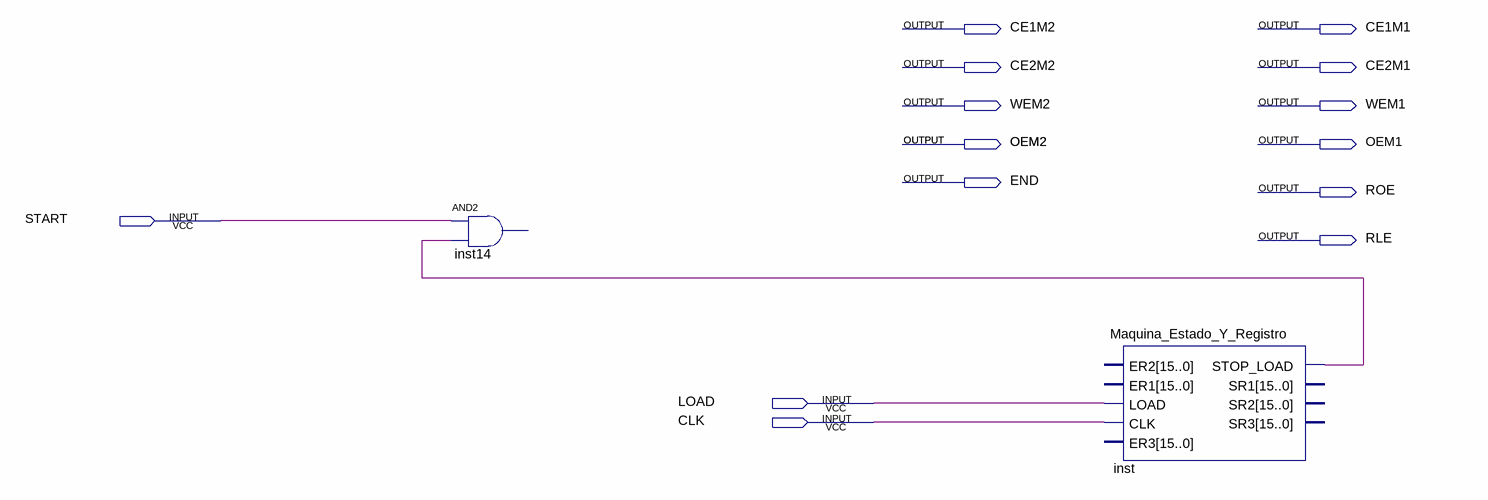
[diagram p0: schematic sheet]
// Quartus schematic Modulo_de_control_general.bdf as structural Verilog: 2 symbols, 15 pins
module Modulo_de_control_general (
  input  START,
  input  LOAD,
  input  CLK,
  output CE1M2,
  output CE1M1,
  output CE2M2,
  output CE2M1,
  output WEM2,
  output WEM1,
  output OEM2,
  output OEM1,
  output END,
  output ROE,
  output RLE
);

  wire inst_stop_load;

  // AND2 inst14 has open pins: IN1=START, IN2=inst_stop_load, OUT=open
  Maquina_Estado_Y_Registro inst (
    .LOAD(LOAD), .CLK(CLK), .STOP_LOAD(inst_stop_load));  // open: ER2, ER1, ER3, SR1, SR2, SR3
endmodule
